# EAGLE schematic lampeggio_led (EAGLE 9.6.2)
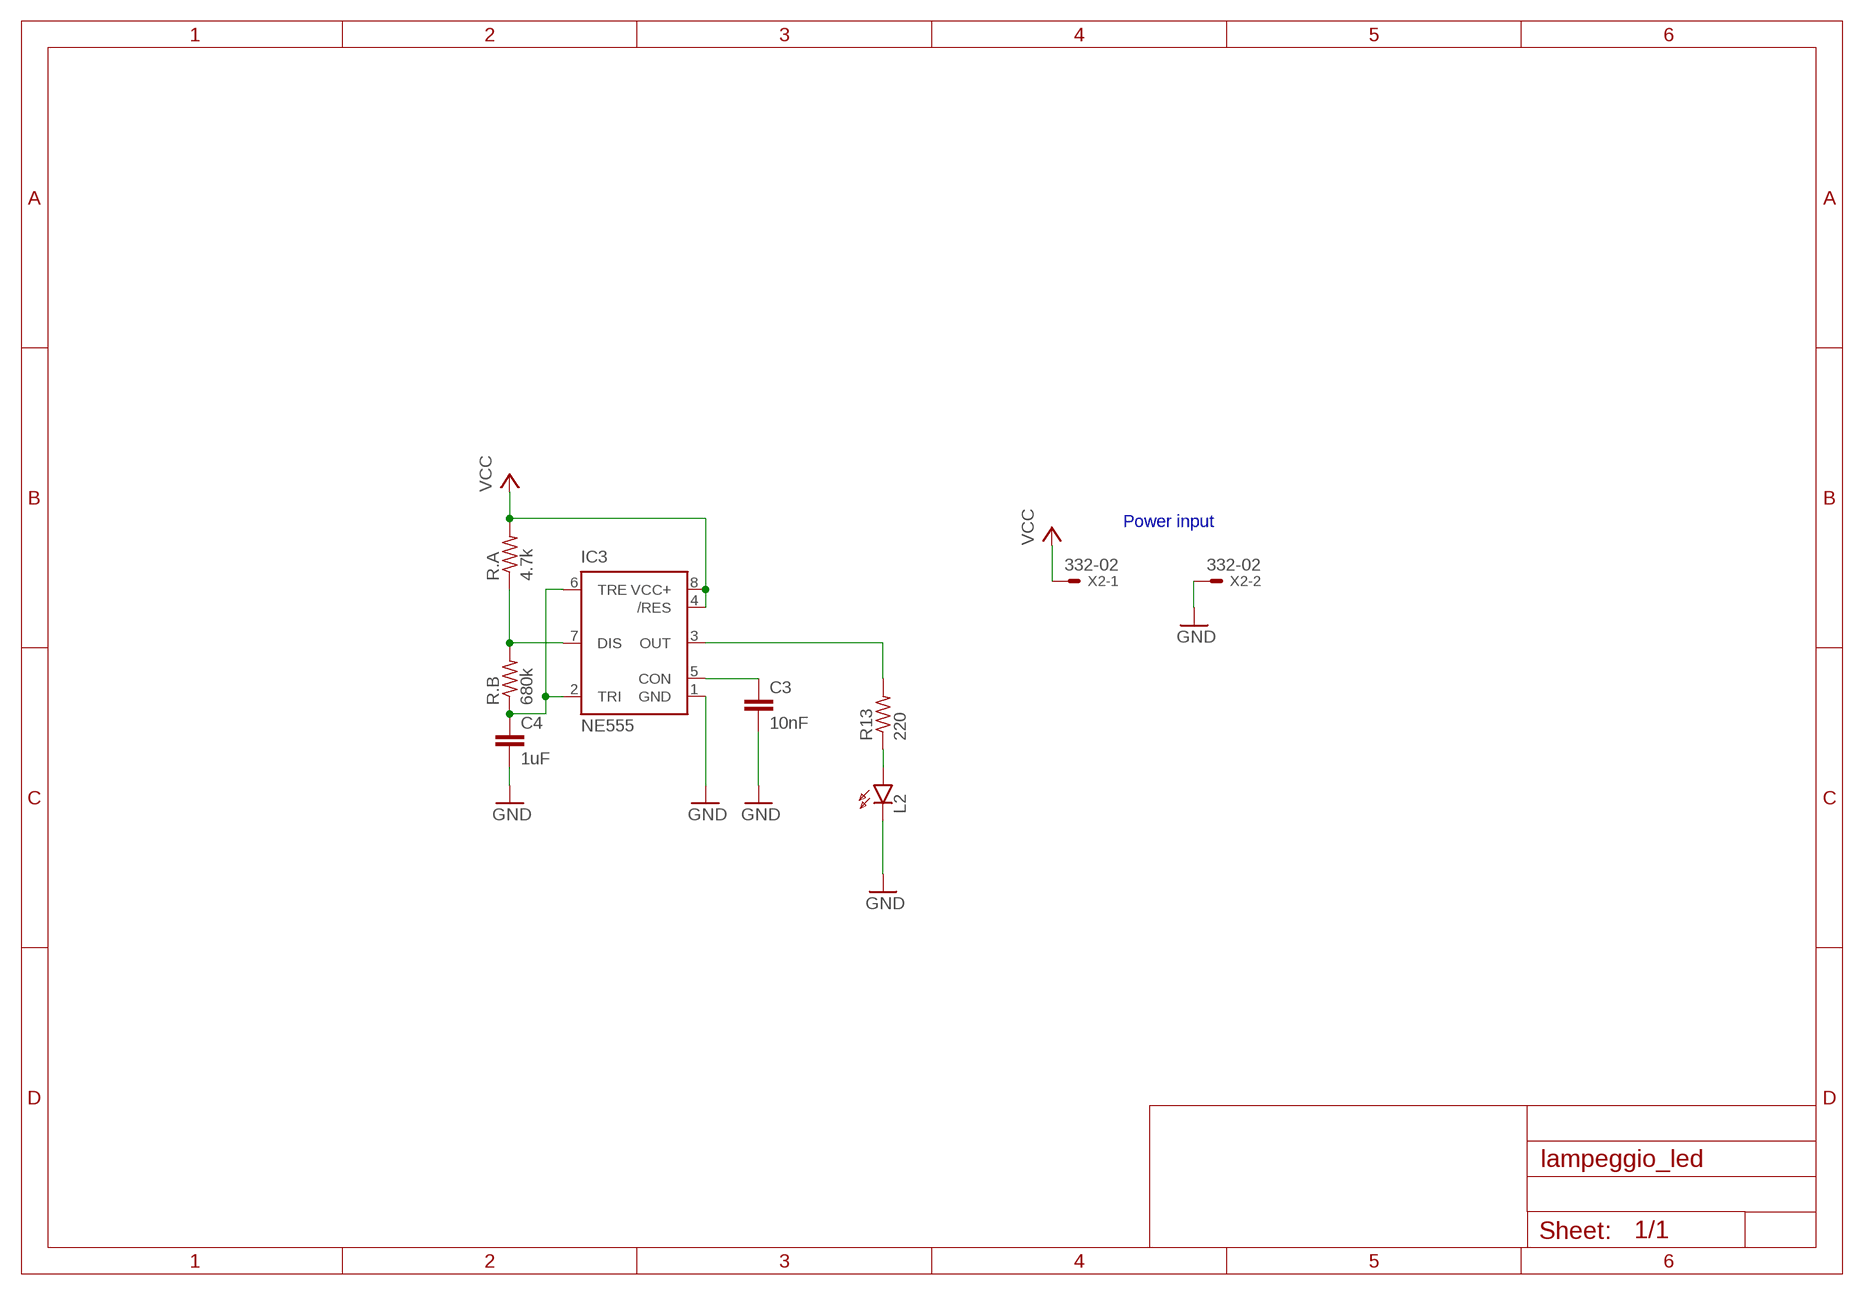
[diagram p0: schematic, sheet 1]

## Parts
C3  10nF  C-EU025-024X044  [C025-024X044]
C4  1uF  C-EU025-024X044  [C025-024X044]
IC3  NE555  [DIL-08]
L2  HLMP6  [HLMP6]
R13  220  R-US_0207/10  [0207/10]
R.A  4.7k  R-US_0207/10  [0207/10]
R.B  680k  R-US_0207/10  [0207/10]
X2  332-02  [332-02]

## Nets
GND [GND1]: C3.2 C4.2 IC3.1(GND) L2.K X2.2
N$41: L2.A R13.1
N$55: C3.1 IC3.5(CON)
N$57: IC3.7(DIS) R.A.1 R.B.2
N$58: IC3.3(OUT) R13.2
N$59: C4.1 IC3.2(TRI) IC3.6(TRE) R.B.1
VCC: IC3.4(/RES) IC3.8(VCC+) R.A.2 X2.1

## Notes on the sheet
- Power input

## Library data of the parts
C3 C4 = rcl:C-EU: CAPACITOR, European symbol; SPICEPREFIX: C
IC3 = st-microelectronics:NE555: General purpose bipolar Timer; MF: Arrow Electronics; MPN: NE555N; OC_FARNELL: 1467742; OC_NEWARK: 89K1486
L2 = display-hp:HLMP6: LED 2mm horizontal; MF: AGILENT TECHNOLOGIES; MPN: HLMP-6500; OC_FARNELL: 1652490; OC_NEWARK: 40K0088
R13 R.A R.B = rcl:R-US_: RESISTOR, American symbol; SPICEPREFIX: R
X2 = con-garry:332-02: 2 Pin - 2mm Dual Row Source: www.mpe-connector.de / garry_shortform_2012.pdf